# EAGLE design swbar002 (EAGLE 9.0.1)
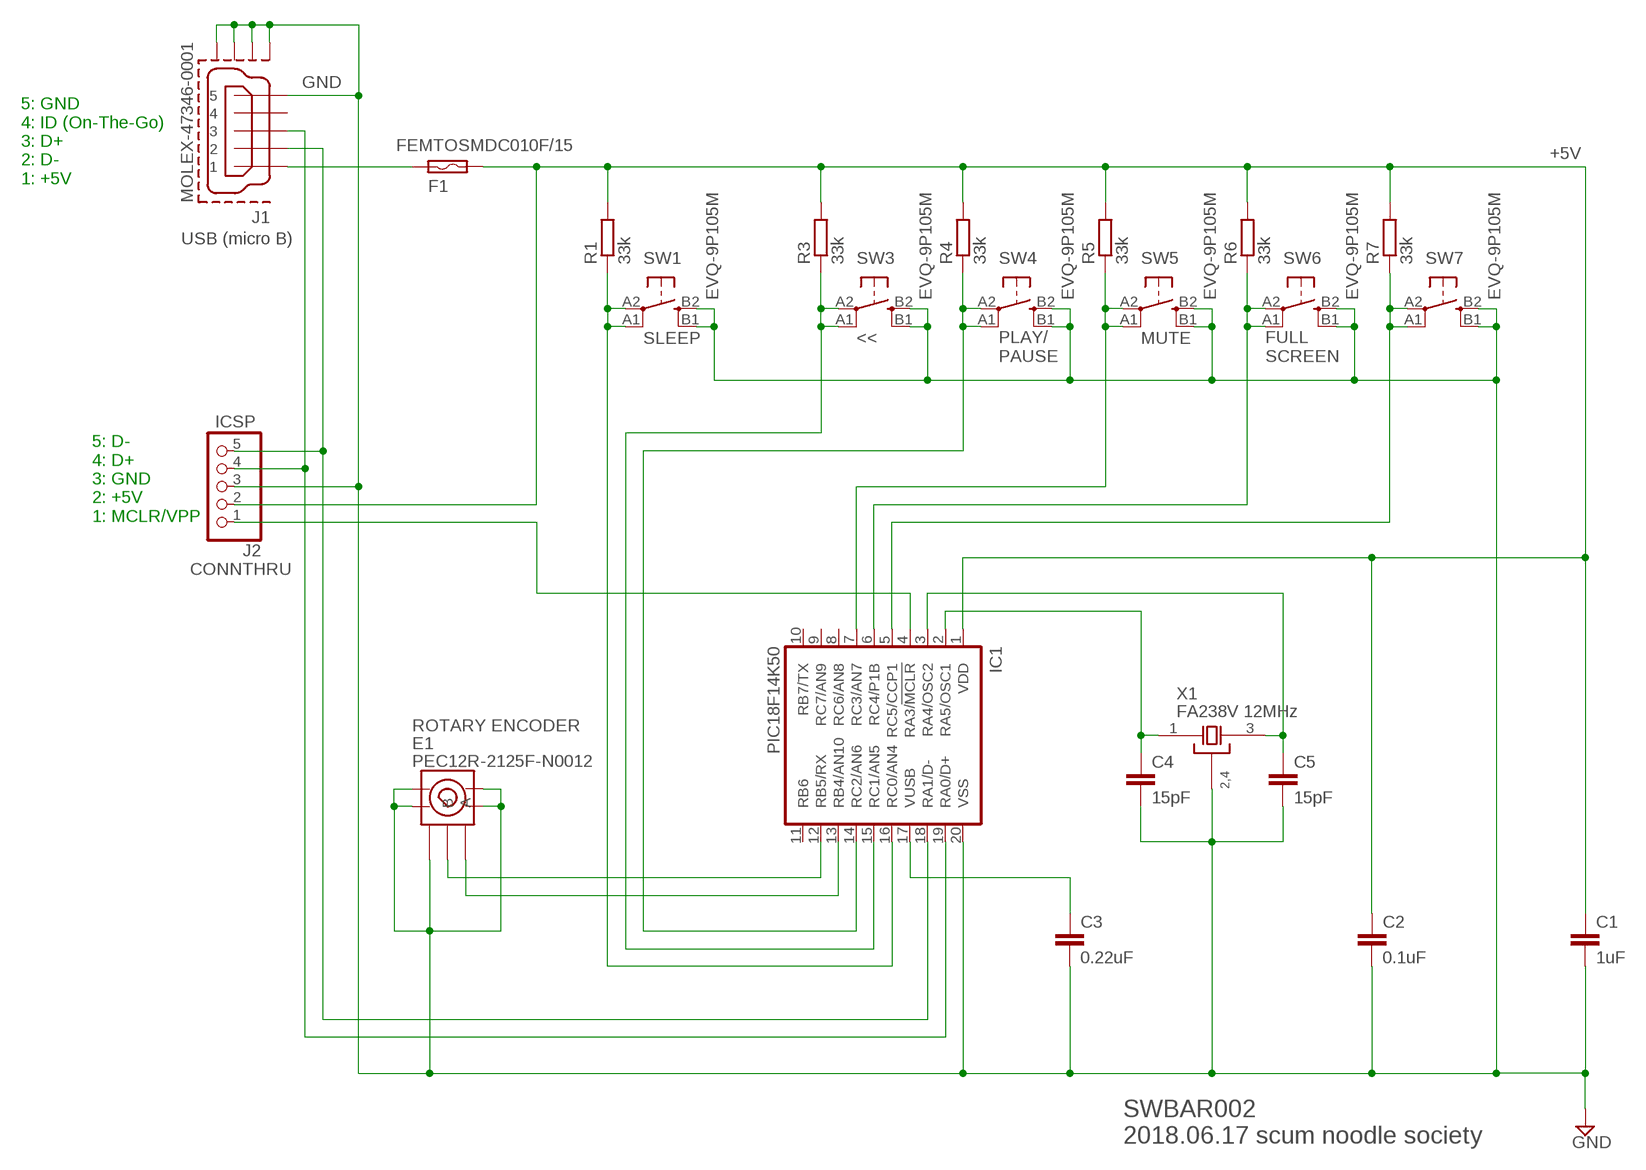
[diagram p0: schematic, sheet 1]

## Parts
C1  1uF  C-EUC0603K  [C0603K]
C2  0.1uF  C-EUC0603K  [C0603K]
C3  0.22uF  C-EUC0603K  [C0603K]
C4  15pF  C-EUC0603K  [C0603K]
C5  15pF  C-EUC0603K  [C0603K]
E1  PEC12R-2125F-N0012  [PEC12R]
F1  FEMTOSMDC010F/15  [C0603K]
IC1  PIC18F14K50  [SSOP20]
J1  MOLEX-47346-0001  [MOLEX-47364-0001]
J2  CONNTHRU  PINHD-1X51X05_CONNTHRU  [1X05_CONNTHRU]
R1  33k  R-EU_R0603  [R0603]
R3  33k  R-EU_R0603  [R0603]
R4  33k  R-EU_R0603  [R0603]
R5  33k  R-EU_R0603  [R0603]
R6  33k  R-EU_R0603  [R0603]
R7  33k  R-EU_R0603  [R0603]
SW1  EVQ-9P105M  [EVQ9P]
SW3  EVQ-9P105M  [EVQ9P]
SW4  EVQ-9P105M  [EVQ9P]
SW5  EVQ-9P105M  [EVQ9P]
SW6  EVQ-9P105M  [EVQ9P]
SW7  EVQ-9P105M  [EVQ9P]
X1  FA238V 12MHz  FA-238V  [XTAL_SMD_32X25]

## Nets
+5V: C1.1 C2.1 F1.2 IC1.1(VDD) J2.2 R1.2 R3.2 R4.2 R5.2 R6.2 R7.2
D+: IC1.19(RA0/D+) J1.3 J2.4
D-: IC1.18(RA1/D-) J1.2 J2.5
GND: C1.2 C2.2 C3.2 C4.2 C5.2 E1.GND@1(GND) E1.GND@2(GND) E1.GND@3(GND) E1.GND@4(GND) E1.GND@5(GND) IC1.20(VSS) J1.5 J1.GND1(GND) J1.GND2(GND) J1.GND3(GND) J1.GND4(GND) J2.3 SW1.B1(G$S1) SW1.B2(G$S2) SW3.B1(G$S1) SW3.B2(G$S2) SW4.B1(G$S1) SW4.B2(G$S2) SW5.B1(G$S1) SW5.B2(G$S2) SW6.B1(G$S1) SW6.B2(G$S2) SW7.B1(G$S1) SW7.B2(G$S2) X1.2(GND) X1.4(GND)
N$1: IC1.16(RC0/AN4) R1.1 SW1.A1(G$P1) SW1.A2(G$P2)
N$2: E1.A IC1.13(RB4/AN10)
N$3: IC1.5(RC5/CCP1) R7.1 SW7.A1(G$P1) SW7.A2(G$P2)
N$4: IC1.6(RC4/P1B) R6.1 SW6.A1(G$P1) SW6.A2(G$P2)
N$5: E1.B IC1.12(RB5/RX)
N$6: IC1.7(RC3/AN7) R5.1 SW5.A1(G$P1) SW5.A2(G$P2)
N$7: IC1.14(RC2/AN6) R4.1 SW4.A1(G$P1) SW4.A2(G$P2)
N$8: IC1.4(RA3/!MCLR!) J2.1
N$9: IC1.15(RC1/AN5) R3.1 SW3.A1(G$P1) SW3.A2(G$P2)
N$10: C3.1 IC1.17(VUSB)
N$11: C5.1 IC1.3(RA4/OSC2) X1.3(X3)
N$12: C4.1 IC1.2(RA5/OSC1) X1.1(X1)
VBUS: F1.1 J1.1
Unconnected: IC1.8(RC6/AN8) IC1.9(RC7/AN9) IC1.10(RB7/TX) IC1.11(RB6) J1.4

## Notes on the sheet
- 5: GND
  4: ID (On-The-Go)
  3: D+
  2: D-
  1: +5V
- USB (micro B)
- SLEEP | << | MUTE
- PLAY/
  PAUSE
- FULL
  SCREEN
- ICSP
- 5: D-
  4: D+
  3: GND
  2: +5V
  1: MCLR/VPP
- ROTARY ENCODER
- SWBAR002
  2018.06.17 scum noodle society

## Library data of the parts
C1-C5 = rcl:C-EU: CAPACITOR, European symbol; SPICEPREFIX: C
E1 = mylib:PEC12R-2125F-N0012: PEC12R-2125F-N0012, ROTARY ENCODER, 2PHASES, RIGHT ANGLE, 6mm DIA SHAFT/D-CUT
F1 = mylib:FEMTOSMDC010F/15: Resettable Fuse Hold:100mA Trip:300mA Size:1608
IC1 = pic18f14k50:PIC18F14K50
J1 = usb_con-update2:MOLEX-47346-0001: MICRO USB B, BOTTOM MOUNT
J2 = mylib:PINHD-1X5: PIN HEADER
R1 R3-R7 = rcl:R-EU_: RESISTOR, European symbol; SPICEPREFIX: R
SW1 SW3-SW7 = mylib:EVQ-9P105M: Panasonic Tactile Switch
X1 = xtal:FA-238V: EPSON TOYOCOM FA238V, SMD, 4 PAD

## Board
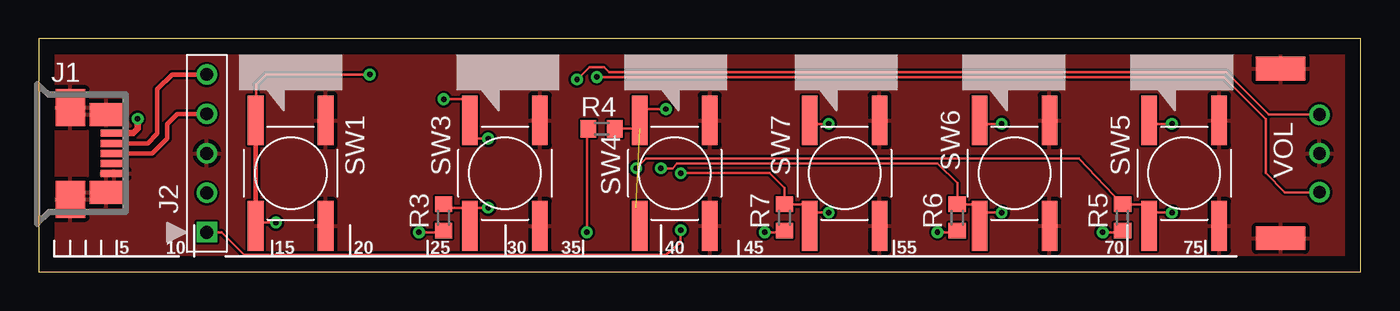
[diagram p1: board, top side]
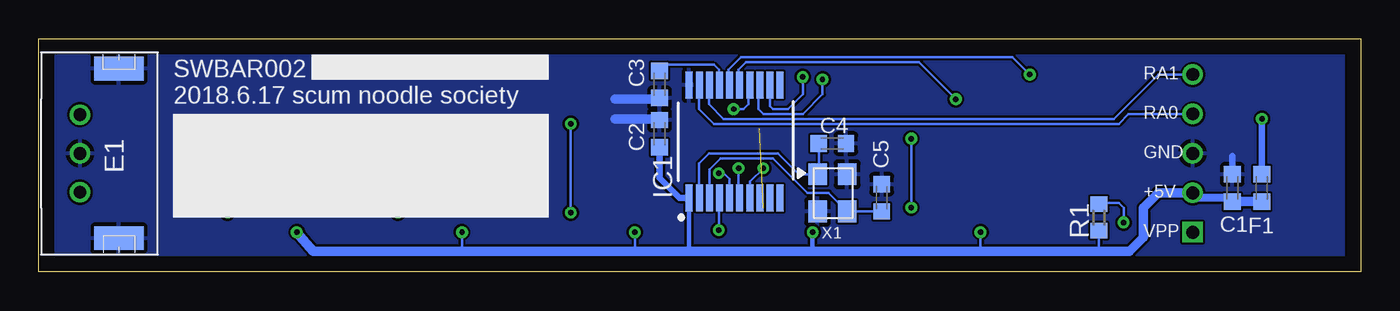
[diagram p2: board, bottom side, seen from below]

Size 85 x 15 mm. Coordinates in mm from the lower left corner, seen from the top.
Outline: 0,0 85,0 85,15 0,15 0,0
Copper layers (1*16): Top 0.035mm / dielectric 1.5mm / Bottom 0.035mm
Design rules "default": minimum track width 6mil, minimum drill 0.35mm, track to track 6mil, track to pad 6mil, pad to pad 6mil, via to via 6mil, smd to smd 6mil, copper to edge 40mil, drill to drill 6mil, minimum pad ring 10mil, minimum via ring 8mil, stop-mask expansion 4mil, vias tented up to drill 0mil, thermal gap 10mil

### Footprints (pad centres in the part's own frame; a part is rotated, then mirrored left to right if it is on the bottom)
C0603K = smd 1.05 x 1.08: 1 -0.875,0; 2 0.875,0
PEC12R = drill 0.813: A -2.5,-2.5; B 2.5,-2.5; GND@1 0,-2.5 | smd 1.524 x 3.175: GND@2 -5.461,0; GND@4 5.461,0 | smd 1.524 x 3.175 bottom: GND@3 -5.461,0; GND@5 5.461,0
SSOP20 = smd 1.75 x 0.45: 1 0,0; 2 0,-0.65; 3 0,-1.3; 4 0,-1.95; 5 0,-2.6; 6 0,-3.25; 7 0,-3.9; 8 0,-4.55; 9 0,-5.2; 10 0,-5.85; 11 7.25,-5.85; 12 7.25,-5.2; 13 7.25,-4.55; 14 7.25,-3.9; 15 7.25,-3.25; 16 7.25,-2.6; 17 7.25,-1.95; 18 7.25,-1.3; 19 7.25,-0.65; 20 7.25,0
MOLEX-47364-0001 = smd 1.7 x 0.45: 1 2.8,1.3; 2 2.8,0.65; 3 2.8,0; 4 2.8,-0.65; 5 2.8,-1.3 | smd 1.9 x 2.375: GND1 0,2.95; GND4 0,-2.95 | smd 2.1 x 1.475: GND2 2.3,2.5; GND3 2.3,-2.5
1X05_CONNTHRU = drill 0.813 square: 1 0,0 | drill 0.813: 2 2.54,0; 3 5.08,0; 4 7.62,0; 5 10.16,0
R0603 = smd 1 x 1.1: 1 -0.85,0; 2 0.85,0
EVQ9P = smd 1 x 3.2: A1 -2.25,3.4; A2 -2.25,-3.4; B1 2.25,3.4; B2 2.25,-3.4
XTAL_SMD_32X25 = smd 1.4 x 1.2: 1 -1.2,-0.95; 2 1.2,-0.95; 3 1.2,0.95; 4 -1.2,0.95

### Placement (x,y rotation side)
C1  8.26,5.4 90 bottom
C2  45.09,8.89 90 bottom
C3  45.09,12.06 270 bottom
C4  33.97,8.26 0 bottom
C5  30.8,4.76 90 bottom
E1  79.85,7.62 270 bottom
F1  6.35,5.4 270 bottom
IC1  43.18,4.76 90 bottom
J1  2.03,7.62 0 top
J2  10.79,2.54 90 top
R1  16.83,3.49 270 bottom
R3  26.04,3.49 270 top
R4  36.2,9.21 180 top
R5  69.69,3.49 270 top
R6  59.05,3.49 270 top
R7  47.94,3.49 270 top
SW1  16.19,6.35 0 top
SW3  29.97,6.35 0 top
SW4  40.89,6.35 0 top
SW5  73.66,6.35 0 top
SW6  62.74,6.35 0 top
SW7  51.82,6.35 0 top
X1  33.97,5.08 270 bottom

### Tracks (layer width: path | path; a pad name or v marks a point on that pad's centre or on a via)
+5V  (via drill 0.35)
  Top 0.152: R6.2 58.95,2.54 v57.78,2.54 | R7.2 47.84,2.54 v46.67,2.54 | R5.2 69.59,2.54 v68.42,2.54 | R3.2 25.93,2.54 v24.45,2.54 | v35.24,2.54 35.24,9.21 R4.2
  Bottom 0.152: R1.2 16.83,1.32 | v46.67,2.54 46.67,1.32 | 57.78,1.32 v57.78,2.54 | v24.45,2.54 24.45,1.32
  Bottom 0.305: IC1.1 43.18,1.32 | 35.24,1.32 v35.24,2.54
  Bottom 0.406: C2.1 45.09,6.03 43.81,4.76 IC1.1
  Bottom 0.508: C1.1 8.49,4.76 10.48,4.76 J2.2
  Bottom 0.61: J2.2 13.02,5.08 13.97,4.13 13.97,2.22 14.87,1.32 16.83,1.32 24.45,1.32 35.24,1.32 43.18,1.32 46.67,1.32 57.78,1.32 67.36,1.32 v68.42,2.54 | C1.1 F1.2
D+
  Top 0.305: J2.4 8.89,10.16 8.26,9.53 8.26,8.57 7.3,7.62 J1.3
  Bottom 0.152: J2.4 14.92,10.16 15.56,9.53 41.59,9.53 42.55,10.48 42.55,11.43 42.53,11.45 IC1.19
D-
  Top 0.305: J2.5 8.57,12.7 7.62,11.75 7.62,8.89 6.99,8.26 4.85,8.26 J1.2
  Bottom 0.152: J2.5 13.02,12.7 15.88,9.84 40.96,9.84 41.91,10.79 41.91,11.98 IC1.18
GND
  Bottom 0.406: 8.26,7.46 C1.2
  Bottom 0.61: C3.2 45.09,11.11 47.94,11.11 | C2.2 45.09,9.84 47.94,9.84
  pour Top: 0.32,14.61 84.93,14.61 84.93,0.32 0.32,0.32
  pour Bottom: 84.61,14.61 0.19,14.86 0.19,0.32 84.61,0.32
N$1  (via drill 0.35)
  Top 0.152: SW1.A2 14.17,3.17 v15.24,3.17 | SW1.A1 13.97,9.78 13.97,12.06 14.61,12.7 v21.27,12.7
  Top 0.305: SW1.A1 SW1.A2 13.62,2.25 13.65,2.22
  Bottom 0.152: v15.24,3.17 15.24,4.13 15.56,4.45 16.73,4.45 R1.1 | IC1.16 40.64,12.07 40.64,13.02 39.85,13.81 22.38,13.81 v21.27,12.7
N$2  (via drill 0.35)
  Top 0.152: v34.61,12.38 35.4,13.18 36.35,13.18 36.67,12.86 76.36,12.86 79.1,10.12 E1.A
  Bottom 0.152: IC1.13 38.73,11.91 38.73,10.48 38.42,10.16 35.88,10.16 34.61,11.43 v34.61,12.38
N$3  (via drill 0.35)
  Top 0.152: v41.27,6.35 46.99,6.35 47.94,5.4 R7.1 49.11,4.34 49.21,4.45 49.53,4.13 49.53,3.81 | SW7.A1 49.73,9.53 v50.8,9.53 | 49.53,3.81 49.5,3.78 SW7.A2 | 49.53,3.81 v50.8,3.81
  Bottom 0.152: IC1.5 40.58,5.97 40.96,6.35 v41.27,6.35 | v50.8,3.81 v50.8,9.53
N$4  (via drill 0.35)
  Top 0.152: SW6.A2 60.62,3.78 60.64,3.81 | v61.91,3.81 60.64,3.81 | 60.62,9.5 60.64,9.53 v61.91,9.53 | 60.33,9.21 60.62,9.5 | 60.62,9.5 SW6.A1 | v40.01,6.67 40.73,6.67 41.05,6.99 57.78,6.99 59.05,5.71 R6.1 60.54,4.34 60.64,4.45 60.64,3.81
  Bottom 0.152: v61.91,9.53 v61.91,3.81 | IC1.6 40.01,4.84 v40.01,6.67
N$5  (via drill 0.35)
  Top 0.152: v35.88,12.54 76.2,12.54 78.9,9.84 78.9,6.35 80.13,5.12 E1.B
  Bottom 0.152: IC1.12 37.98,10.68 37.78,10.48 36.83,10.48 35.88,11.43 v35.88,12.54
N$6  (via drill 0.35)
  Top 0.152: v72.86,3.81 71.59,3.81 | 71.59,3.81 71.25,3.46 SW5.A2 | SW5.A1 71.47,9.53 v72.86,9.53 | 71.59,3.81 71.59,4.13 71.28,4.45 71.17,4.34 R5.1 66.89,7.3 39.05,7.3 v38.42,6.67
  Bottom 0.152: v72.86,9.53 v72.86,3.81 | IC1.7 39.28,5.8 v38.42,6.67
N$7  (via drill 0.35)  (1 unrouted)
  Top 0.152: 38.64,3.17 38.64,3.72 38.73,3.81 38.42,4.13 | 38.64,3.17 SW4.A2 | v40.32,10.48 38.73,10.48 38.64,10.39 SW4.A1 38.64,9.21 R4.1 | 38.73,3.27 38.64,3.17
  Bottom 0.152: IC1.14 39.37,12.1 39.37,10.79 39.69,10.48 v40.32,10.48
N$8  (via drill 0.35)
  Top 0.152: J2.1 11.75,2.54 13.2,1.09 40.32,1.09 41.27,1.91 v41.27,2.68
  Bottom 0.152: v41.27,2.68 41.27,4.72 IC1.4
N$9  (via drill 0.35)
  Top 0.152: R3.1 26.25,4.13 27.62,4.13 | 27.62,4.13 27.72,4.03 SW3.A2 | v26.04,11.11 27.94,11.11 27.72,10.89 SW3.A1 27.72,8.67 27.62,8.57 v28.89,8.57 | 27.62,4.13 v28.89,4.13
  Bottom 0.152: v26.04,11.11 28.42,13.49 39.53,13.49 40.01,13.02 40.01,12.09 IC1.15 | v28.89,8.57 v28.89,4.13
N$10
  Bottom 0.152: IC1.17 41.23,12.65 41.27,12.7 41.27,13.02 41.59,13.34 44.69,13.34 C3.1
N$11
  Bottom 0.152: IC1.3 41.88,6.1 41.88,6.6 41.18,7.3 37.78,7.3 35.56,5.08 34.22,5.08 X1.3 C5.1
N$12
  Bottom 0.152: X1.1 35.24,6.28 | 35.24,6.28 36.12,6.28 37.47,7.62 41.91,7.62 42.55,6.99 42.55,4.78 IC1.2 | C4.1 34.85,6.67 35.24,6.28
VBUS  (via drill 0.35)
  Top 0.406: J1.1 6.06,8.92 6.35,9.21 v6.35,9.84
  Bottom 0.406: v6.35,9.84 F1.1

### Text on the board
tPlace: VOL | 5 | 10 | 15 | 20 | 25 | 30 | 35 | 40 | 45 | 55 | 70 | 75
bPlace: RA1 | SWBAR002 / 2018.6.17 scum noodle society | RA0 | GND | +5V | VPP
bNames: E1